# Altium schematic sheet Differential_Opamp.SchDoc
size A4; SheetNumber: 2; SheetTotal: 4
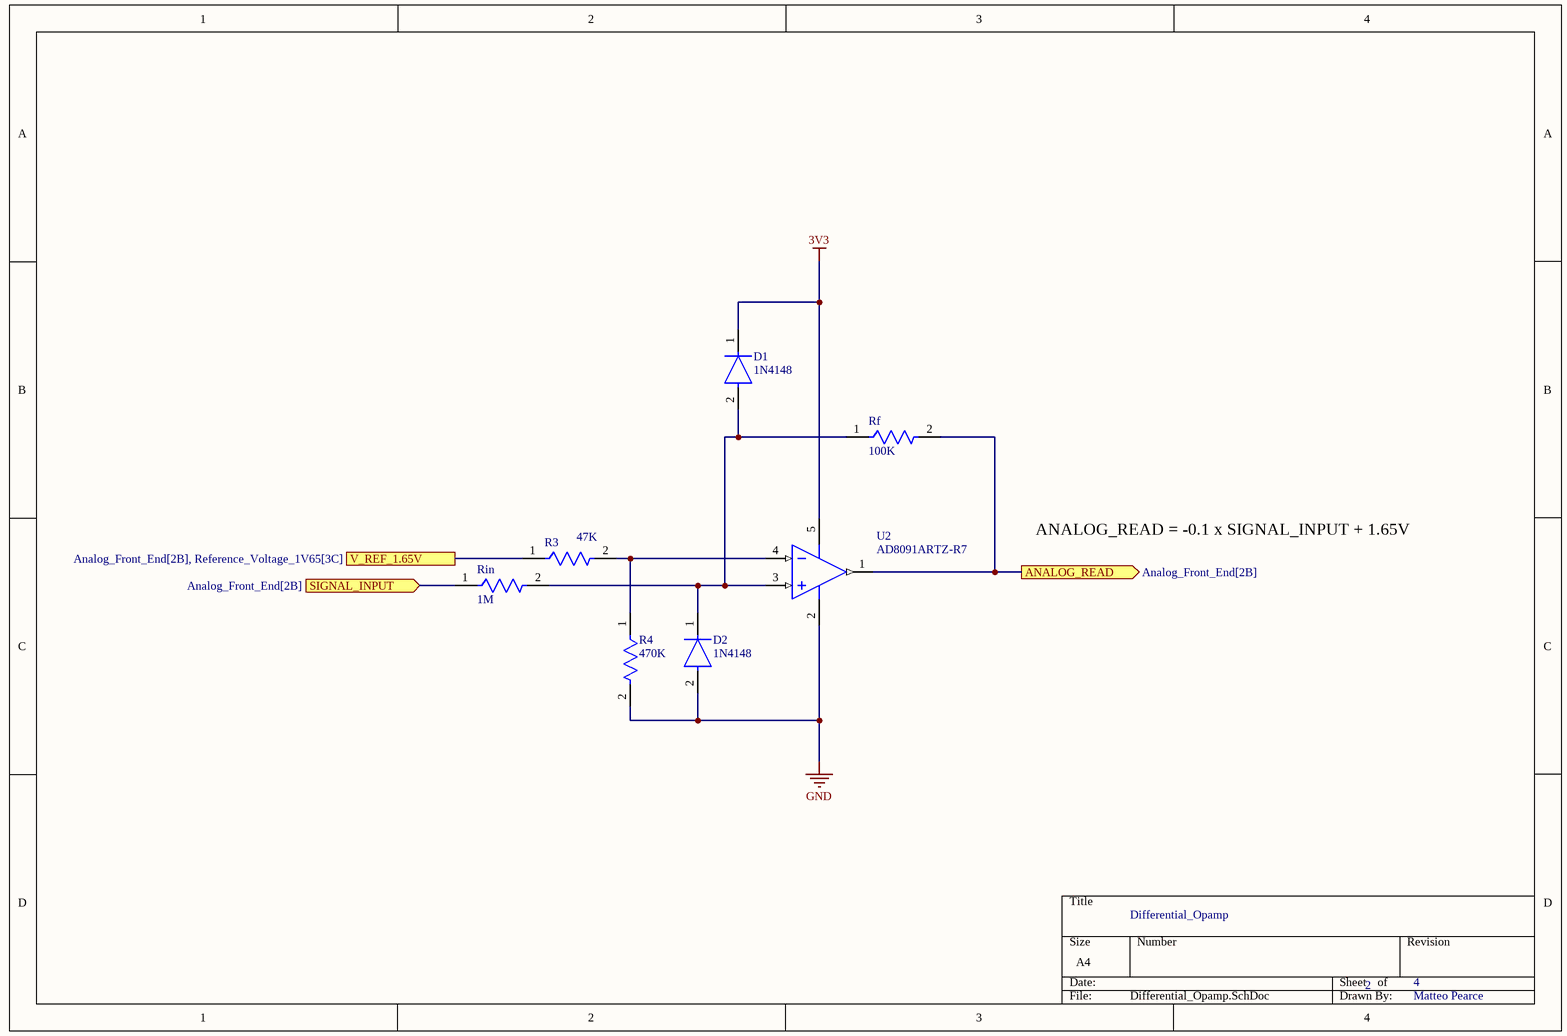
[diagram p0: Differential_Opamp.SchDoc]

## Parts
D1  1N4148  [FP-017AG-MFG]
D2  1N4148  [FP-017AG-MFG]
R3  47K  [FP-CR1206-IPC_B]
R4  470K  [FP-CR1206-IPC_C]
Rf  100K  [FP-RP73P-1J-MFG]
Rin  1M  [FP-MCR01-IPC_B]
U2  AD8091ARTZ-R7  [ADI-RJ-5_M]

## Ports
ANALOG_READ (out, see Analog_Front_End[2B]), SIGNAL_INPUT (in, see Analog_Front_End[2B]), V_REF_1.65V (see Analog_Front_End[2B], Reference_Voltage_1V65[3C])

## Nets
3V3: D1.1(C) U2.5(+VS)
GND: D2.2(A) R4.2 U2.2(-VS)
ANALOG_READ: Rf.2 U2.1(VOUT) ; port ANALOG_READ
SIGNAL_INPUT: Rin.1 ; port SIGNAL_INPUT
V_REF_1.65V: R3.1 ; port V_REF_1.65V
NetD1_2: D1.2(A) D2.1(C) Rf.1 Rin.2 U2.3(+IN)
NetR3_2: R3.2 R4.1 U2.4(-IN)

## Notes on the sheet
- ANALOG_READ = -0.1 x SIGNAL_INPUT + 1.65V
- Differential_Opamp
- 2
- 4
- Matteo Pearce

## Library data of the parts
D1 D2 = CMP-07163-000046-1: DIODE GEN PURP 100V 200MA DO35; Forward Voltage: 1V; Max Power Dissipation: 500mW; Max Reverse Current: 5uA; Forward Current: 300mA; Current: 4A; Reverse Recovery Time: 4ns; Element Configuration: Single; Outside Diameter: 1.85mm; Capacitance: 4pF; Polarity: Standard; Max Forward Surge Current (Ifsm): 1A; Reverse Voltage: 100V; Output Current: 200mA; Average Rectified Current: 200mA; Diameter: 1.91mm; Max Repetitive Reverse Voltage (Vrrm): 100V; Current Rating: 200mA; Case/Package: DO-35; Lead Free: Lead Free; Number of Pins: 2; Recovery Time: 4ns; Packaging: Bulk; Contact Plating: Tin; Voltage: 100V; Mount: Through Hole; Max Surge Current: 4A; Package Quantity: 2000; Width: 1.91mm; Max Reverse Voltage (DC): 100V; Length: 4.56mm; Radiation Hardening: No; Power Dissipation: 500mW; Voltage Rating (DC): 100V; Peak Non-Repetitive Surge Current: 4A; REACH SVHC: No SVHC; Height: 4.56mm; Max Operating Temperature: 175°C; Series: -; Weight: 0.01lb; Min Operating Temperature: -65°C
R3 = CMP-07231-000888-1: Thick Film Chip Resistors 1206 47kΩ 0.25W 1% 100ppm/°C; Max Power Dissipation: 250mW; Voltage Rating: 200V; Resistance: 47kR; Contact Plating: Tin; Length: 3.2mm; Composition: Thick Film; Mount: Surface Mount; Temperature Coefficient: 100ppm/°C; Width: 1.6mm; Min Operating Temperature: -55°C; Case Code (Imperial): 1206; Number of Terminations: 2; Military Standard: Not; Case Code (Metric): 3216; Radiation Hardening: No; Height: 0.03inch; Packaging: Tape and Reel; Voltage Rating (DC): 200V; Case/Package: 1206; REACH SVHC: No SVHC; Tolerance: 1%; Power Rating: 250mW; Max Operating Temperature: 155°C; Package Quantity: 1; Features: Moisture Resistant; Depth: 1.6mm; Termination: SMD/SMT; Thickness: 610um
R4 = CMP-07231-003544-1: Thick Film Chip Resistors 1206 470kΩ 0.25W 1% 100ppm/°C; Power Rating: 250mW; Resistance: 470kR; Voltage Rating: 200V; Case Code (Imperial): 1206; Length: 3.2mm; Case Code (Metric): 3216; Max Power Dissipation: 250mW; Temperature Coefficient: 100ppm/°C; Height: 0.03inch; Min Operating Temperature: -55°C; Tolerance: 1%; Width: 1.6mm; Termination: SMD/SMT; Max Operating Temperature: 155°C; Mount: Surface Mount; Number of Terminations: 2; Packaging: Tape and Reel; Composition: Thick Film; Depth: 1.6mm; Radiation Hardening: No; Thickness: 610um; Contact Plating: Tin; Case/Package: 1206; Military Standard: Not; Package Quantity: 5000
Rf = CMP-03211-000104-1: RES SMD 100K OHM 0.1% 1/6W 0603; Manufacturer Part Number: RP73PF1J100KBTDF; Manufacturer: TE Connectivity; Power Rating: 0.166W; Value: 100KΩ; Description: RP73P 0603 100KΩ 0.166W 25ppm/°C 0.10% 100V; Temperature Coefficient: 25ppm/°C; Tolerance: 0.001; Voltage Rating: 100V; Digikey Description: RES SMD 100K OHM 0.1% 1/6W 0603; Temperature Range High: +155°C; Ipc Land Pattern Name: RESC15580X45; Temperature: -55°C to +155°C; Series: RP73P; Height: 0.55mm; Composition: Thin Film; Automotive: No; Temperature Range Low: -55°C; Resistance: 100KΩ; Package: RP73P-1J; RoHS: TRUE; Octopart: https://octopart.com/rp73pf1j100kbtdf-te+connectivity-23826702; Category: Res; Lead Free: Yes; Device Class L2: Resistors; ComponentLink2Description: Datasheet; ComponentLink2URL: https://www.te.com/commerce/DocumentDelivery/DDEController?Action=srchrtrv&DocNm=1773272&DocType=DS&DocLang=English; Device Class L3: Chip SMD Resistors; Device Class L1: Passive Components
Rin = CMP-08839-008209-1: Thick Film Chip Resistor, 0402, 1MΩ, 0.5%, 50ppm/°C, 0.063W, 50V; Resistance: 1MR; Power Rating: 63mW; Case/Package: 0402; RoHS Compliant: Yes; Voltage Rating (DC): 50V
U2 = CMP-0384-01537-2: Single Channel Single-Supply Operation Operational Amplifier, 110 MHz BW, 170 V/us SR, Industrial, 5-pin SOT23 (RJ-5), Reel; Manufacturer: Analog Devices; Generic Part Number: AD8091; V Span Min: 3V; Input Offset Voltage: 1.6mV; Small Signal Bandwidth: 110MHz; Amplifiers Per Package: 1; V Span Max: 12V; Input Bias Current: 1.3uA; Iq/Amp: 5.5mA; RevisionNote: Symbol corrected, Pin 2 orientation reversed; PackageReference: RJ-5; DatasheetVersion: Rev. C; Mounting Technology: Surface Mount; ComponentLink3URL: http://www.analog.com/static/imported-files/packages/PKG_PDF/SOT-23(RJ)/RJ_5.pdf; PackageVersion: 121608-A; ComponentLink2Description: Datasheet; ComponentLink2URL: http://www.analog.com/static/imported-files/data_sheets/AD8091_8092.pdf; ComponentLink1URL: http://www.analog.com/en/index.html; ComponentLink3Description: Package Specification; Code_JEDEC: MO-178-AA; PartNumber: AD8091ARTZ-R7; PackageDescription: 5-Pin Small Outline Transistor Package, Body 2.9 x 1.6 mm, Pitch 0.95 mm; Slew Rate: 170V/us; ComponentLink1Description: Manufacturer URL